# EAGLE design action_module (EAGLE 7.2.0)
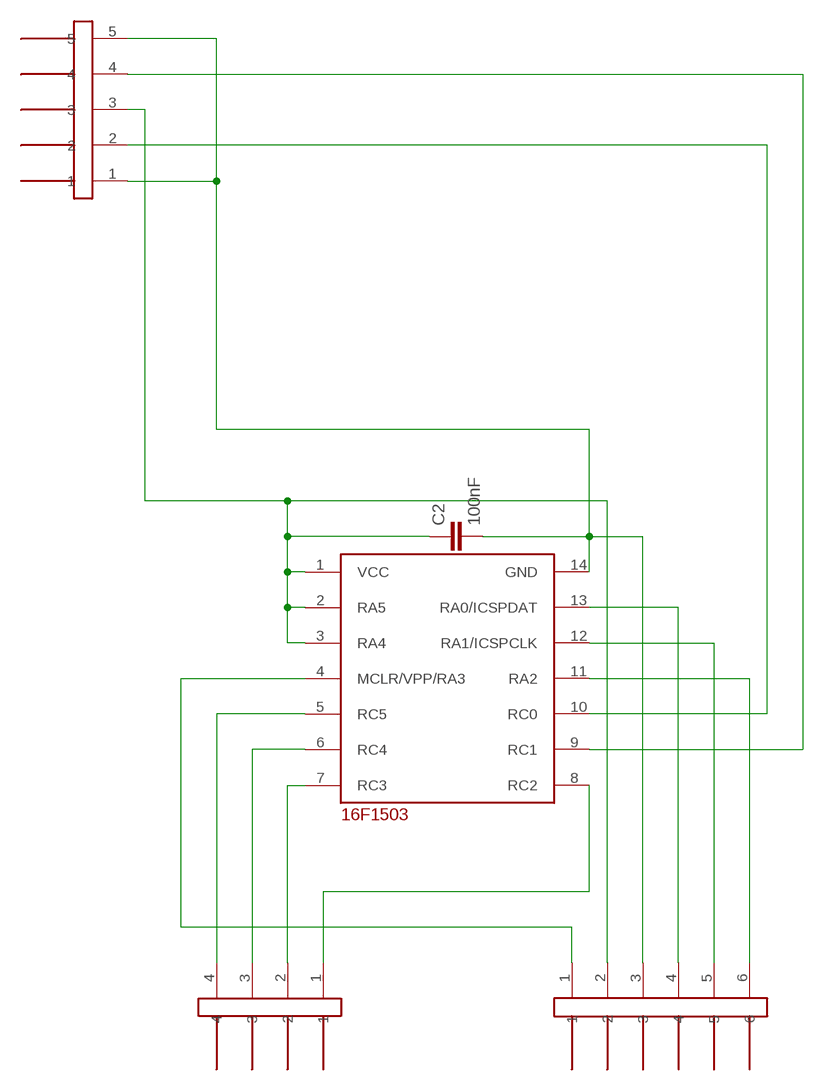
[diagram p0: schematic, sheet 1]

## Parts
C2  100nF  C-EUC0603  [C0603]
U$1  16F103-TSSOP  [TSSOP14]
U$4  JUMPER5M-90  [JUMPER5M-90]
U$8  JUMPER6M  [JUMPER6M]
U$9  JUMPER4M  [JUMPER4M]

## Nets
GND: C2.2 U$1.14(GND) U$4.1 U$4.5 U$8.3
N$1: U$1.7(RC3) U$9.2
N$2: U$1.10(RC0) U$4.2
N$5: U$1.9(RC1) U$4.4
N$11: U$1.11(RA2) U$8.6
N$12: U$1.5(RC5) U$9.4
N$13: U$1.4(MCLR/VPP/RA3) U$8.1
N$14: U$1.13(RA0/ICSPDAT) U$8.4
N$15: U$1.12(RA1/ICSPCLK) U$8.5
N$17: U$1.6(RC4) U$9.3
N$18: U$1.8(RC2) U$9.1
VCC: C2.1 U$1.1(VCC) U$1.2(RA5) U$1.3(RA4) U$4.3 U$8.2

## Library data of the parts
C2 = resistor:C-EU: CAPACITOR, European symbol
U$1 = !stavebnice03:16F103-TSSOP
U$4 = !stavebnice03:JUMPER5M-90
U$8 = !stavebnice03:JUMPER6M
U$9 = !stavebnice03:JUMPER4M

## Board
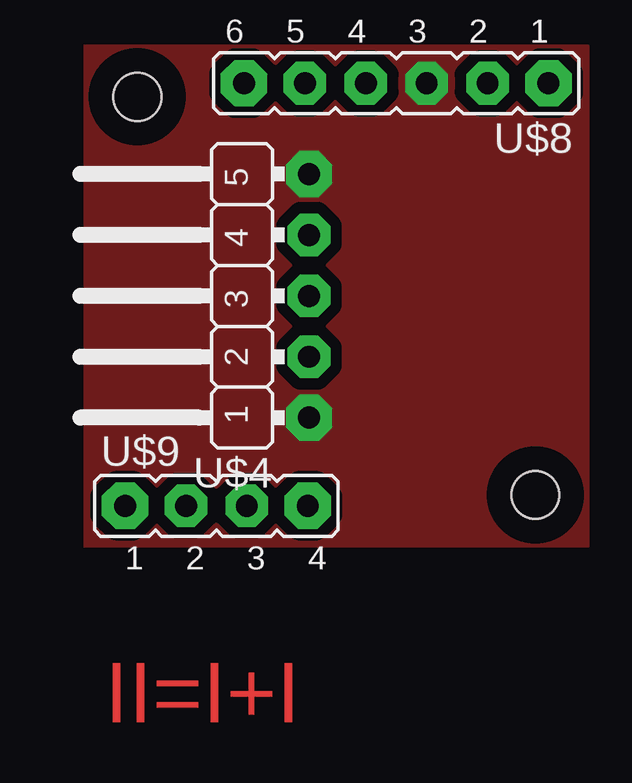
[diagram p1: board, top side]
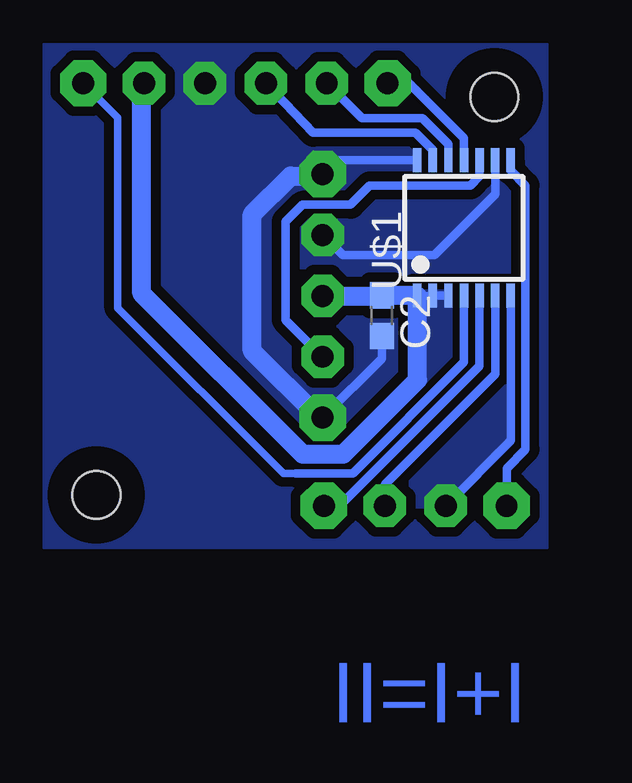
[diagram p2: board, bottom side, seen from below]

No outline drawn. Coordinates in mm, seen from the top.
Copper layers (1*16): Top 0.035mm / dielectric 1.5mm / Bottom 0.035mm
Design rules "default": minimum track width 10mil, minimum drill 24mil, track to track 8mil, track to pad 8mil, pad to pad 8mil, via to via 8mil, smd to smd 8mil, copper to edge 40mil, drill to drill 8mil, minimum pad ring 10mil, minimum via ring 8mil, stop-mask expansion 4mil, vias tented up to drill 0mil, thermal gap 10mil
Holes 2 mm at 2.2,18.8 18.8,2.2

### Footprints (pad centres in the part's own frame; a part is rotated, then mirrored left to right if it is on the bottom)
C0603 = smd 1.1 x 1: 1 -0.85,0; 2 0.85,0
TSSOP14 = smd 0.35 x 1: 1 -1.95,-2.825; 2 -1.3,-2.825; 3 -0.65,-2.825; 4 0,-2.825; 5 0.65,-2.825; 6 1.3,-2.825; 7 1.95,-2.825; 8 1.95,2.825; 9 1.3,2.825; 10 0.65,2.825; 11 0,2.825; 12 -0.65,2.825; 13 -1.3,2.825; 14 -1.95,2.825
JUMPER5M-90 = drill 0.914 pad 1.93 octagon: 1 -5.08,-2.54; 5 5.08,-2.54 | drill 0.914 pad 1.778 octagon: 2 -2.54,-2.54; 3 0,-2.54; 4 2.54,-2.54
JUMPER6M = drill 0.914 pad 1.93 octagon: 1 -6.35,0; 6 6.35,0 | drill 0.914 pad 1.778 octagon: 2 -3.81,0; 3 -1.27,0; 4 1.27,0; 5 3.81,0
JUMPER4M = drill 0.914 pad 1.93 octagon: 1 -3.81,0; 4 3.81,0 | drill 0.914 pad 1.778 octagon: 2 -1.27,0; 3 1.27,0

### Placement (x,y rotation side)
C2  6.9,9.68 270 bottom
U$1  3.47,13.34 0 bottom
U$4  6.82,10.5 90 top
U$8  13,19.37 180 top
U$9  5.5,1.75 0 top

### Tracks (layer width: path | path; a pad name or v marks a point on that pad's centre or on a via)
GND
  Bottom 0.356: C2.2 6.9,7.88 U$4.1 | 9.4,5.4 9.5,5.4 | 9.5,15.5 9.4,15.6 | U$1.14 8.78,16.16 U$4.5
  Bottom 0.8: 9.5,5.4 12.3,8.2 12.3,13.9 10.7,15.5 9.5,15.5
  pour Top (isolate 0.483, rank 2, no thermals): 0,0.03 0,20.95 21,20.95 21,0.03
  pour Bottom (isolate 0.406, no thermals): 0,0 0,21 21,21 21,0
N$1
  Bottom 0.356: U$1.7 1.52,4.46 U$9.2
  pour Bottom (isolate 0.406, no thermals): 1.5,7.6 6.5,2.8 6.6,1.8 4.2,1.8 1.5,4.5
N$2
  Bottom 0.356: U$1.10 2.82,15.48 3.2,15.1 7.4,15.1 8.2,14.3 10.2,14.3 10.9,13.6 10.9,9.5 U$4.2
N$5
  Bottom 0.356: U$1.9 2.17,14.73 4.7,12.2 8.52,12.2 U$4.4
  pour Bottom (isolate 0.406, no thermals): 2.8,16.1 1.5,16.1 1.5,15.7 0.9,15.1 0.9,11 10.7,11 10.7,13.8 10.3,14.2 8.3,14.2 7.4,15 3.2,15 2.8,15.5
N$11
  Bottom 0.356: U$1.11 3.47,17.07 5.8,19.4 6.62,19.4 U$8.6
N$12
  Bottom 0.356: U$1.5 2.82,7.58 8.6,1.8 9.26,1.8 U$9.4
N$13
  Bottom 0.305: 10.5,3.1 11,3.1 17.9,10 17.9,17.92 U$8.1
  Bottom 0.356: U$1.4 3.47,7.73 8.1,3.1 10.5,3.1
N$14
  Bottom 0.356: U$1.13 4.77,16.57 5.5,17.3 9.76,17.3 U$8.4
N$15
  Bottom 0.356: U$1.12 4.12,16.82 5.2,17.9 7.72,17.9 U$8.5
N$17
  Bottom 0.357: U$9.3 6.77,2.63 2.17,7.23 U$1.6
N$18
  Bottom 0.356: U$1.8 1.52,15.72 0.9,15.1
  Bottom 0.357: U$9.1 1.69,3.31 0.9,4.1 0.9,15.1
VCC
  Bottom 0.356: 7.22,10.5 C2.1 7.18,10.51 | 5.4,10.49 U$1.1
  Bottom 0.357: 5.4,10.49 4.79,10.49 U$1.2 U$1.3
  Bottom 0.8: U$1.1 7.18,10.51 | U$4.3 7.22,10.5 | 5.4,10.49 5.4,7 8.5,3.9 10.1,3.9 10.2,3.9 16.9,10.6 16.9,19.28 U$8.2
  pour Bottom (isolate 0.305, no thermals): 3.5,10.6 5.5,10.6 5.5,6.1 3.6,8 3.5,8.1

### Text on the board
Top: II=I+I
Bottom: II=I+I
Dimension: 5 pins - v2